# Altium schematic sheet FRONT_INTF.SchDoc: SDR200
size 420 x 297 mm; DocumentNumber: XXXX.468179.001 Э3; SheetNumber: 7; SheetTotal: 7; Title2str: Передняя панель; DocumentType: Схема электрическая принципиальная; Scale: 1:1
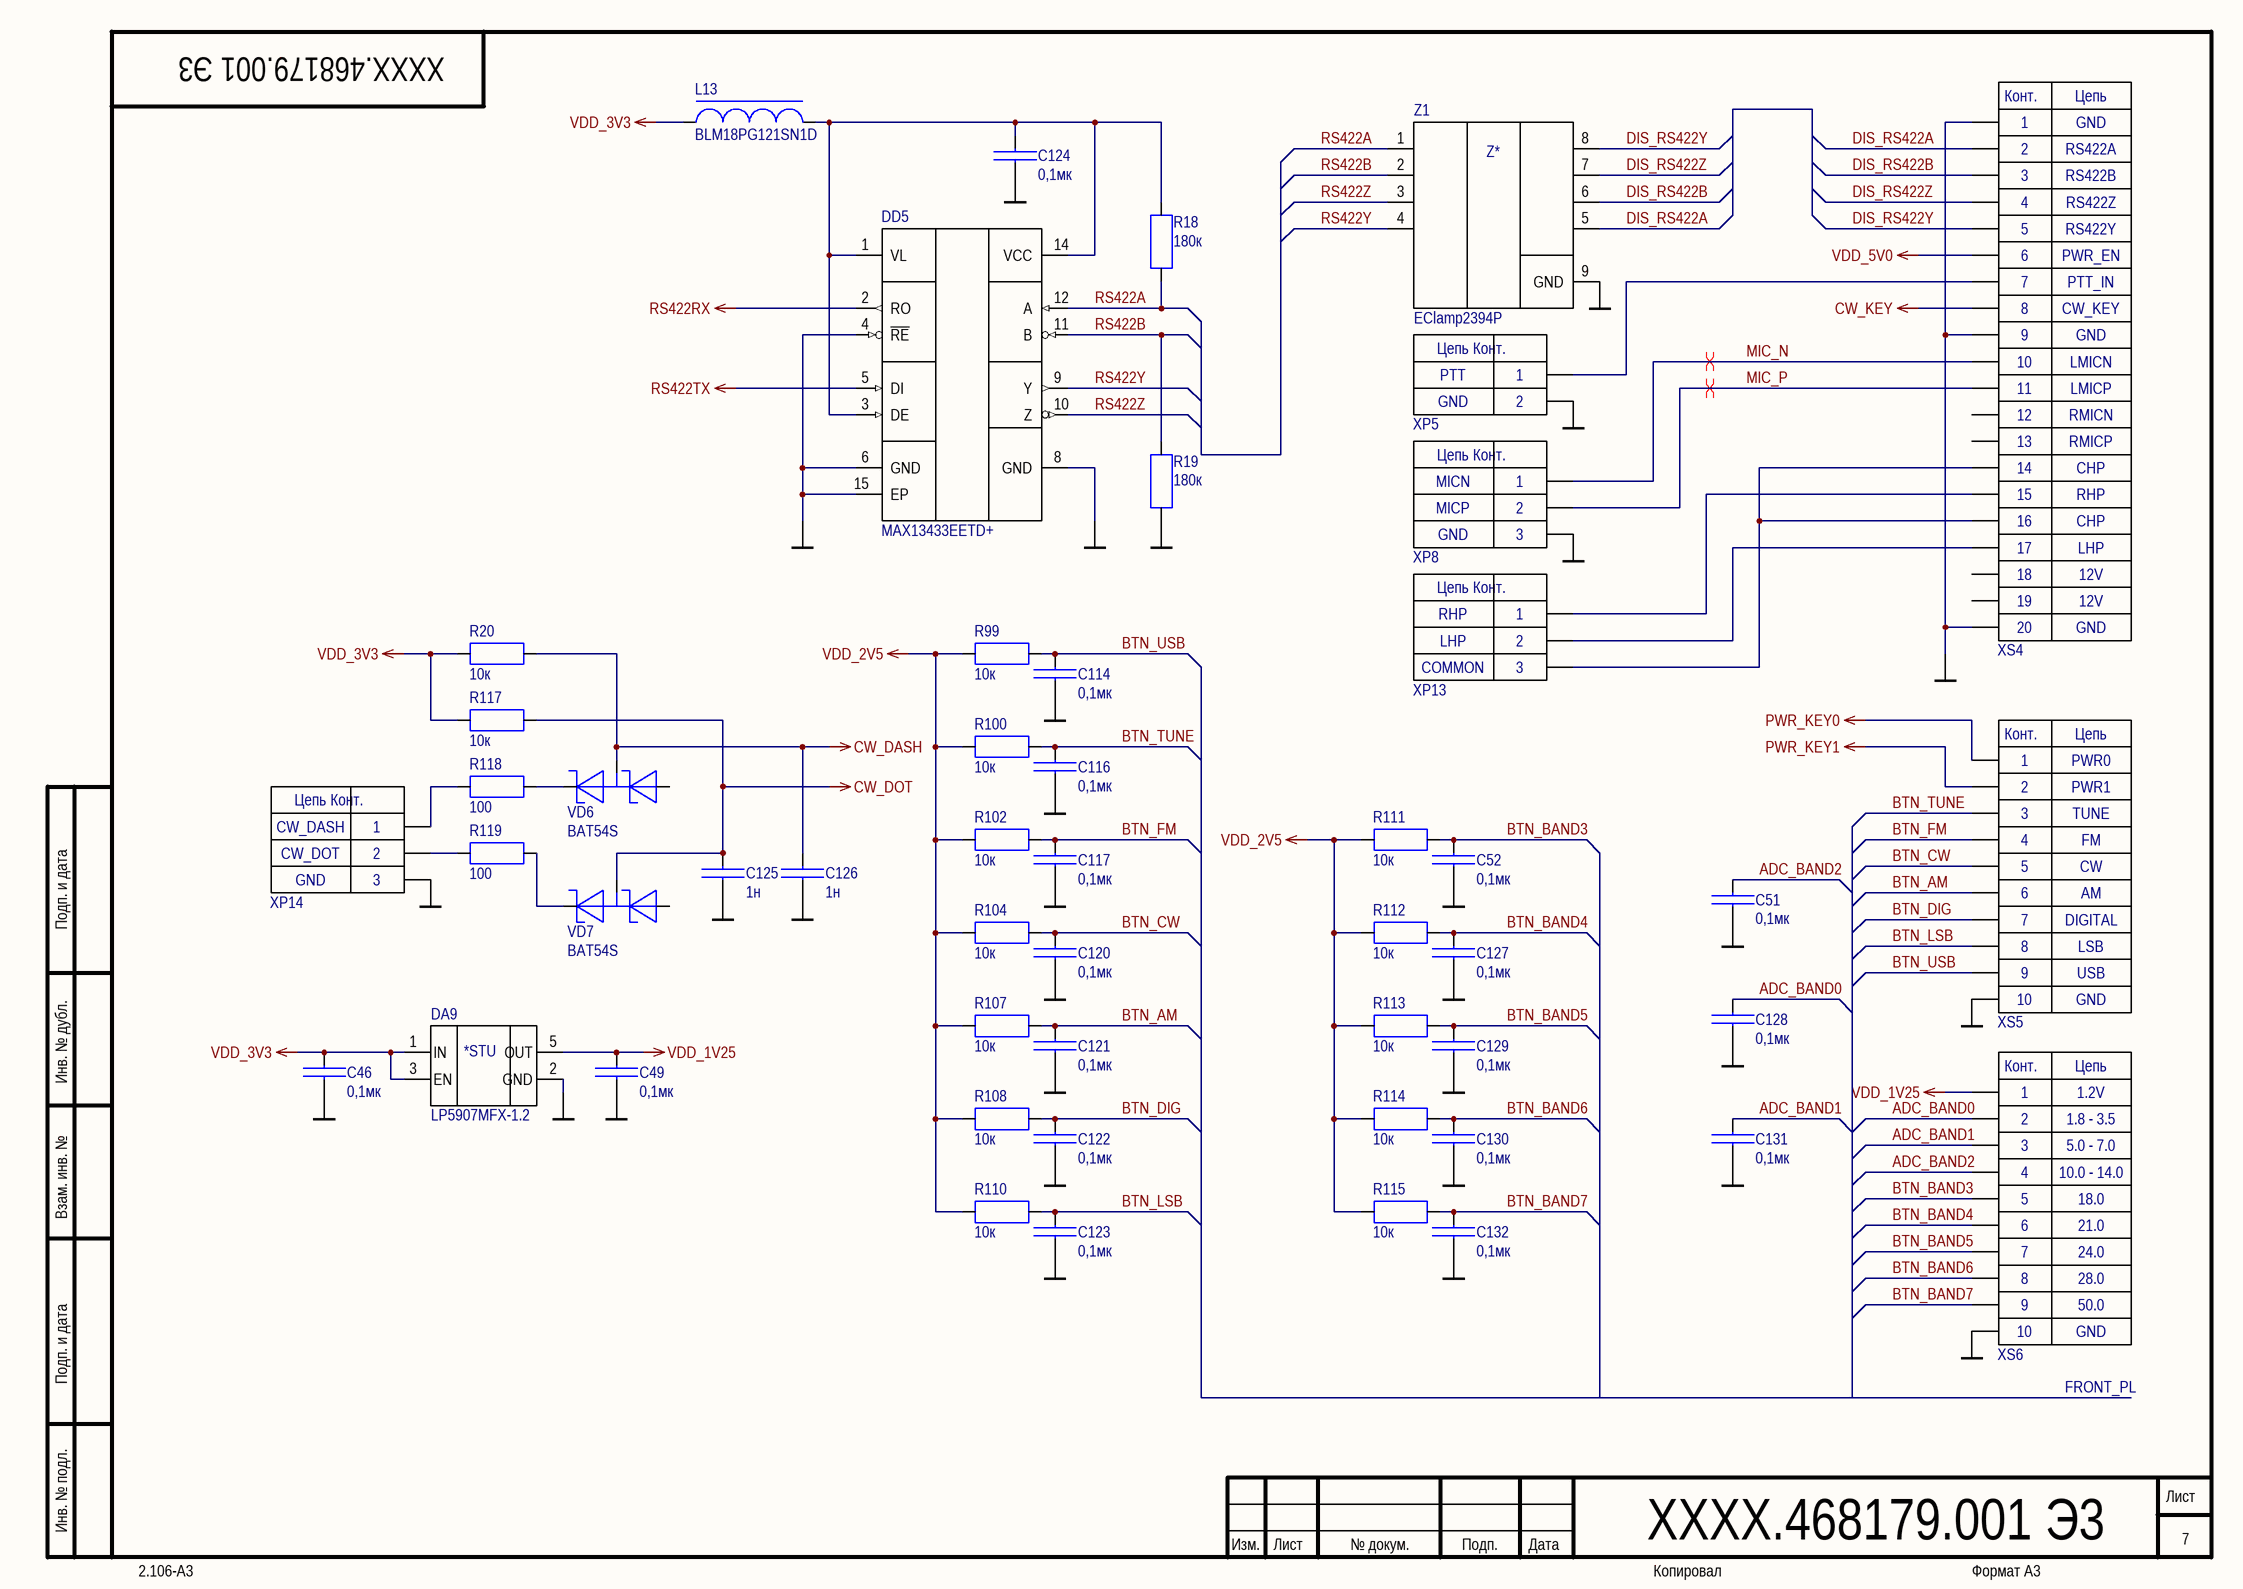
[diagram p0: FRONT_INTF.SchDoc]

## Parts
C46  Nominal: 0,1мк  [CAPC1005X05L]  (hidden comment: CC0402KRX5R6BB104)
C49  Nominal: 0,1мк  [CAPC1005X05L]  (hidden comment: CC0402KRX5R6BB104)
C51  Nominal: 0,1мк  [CAPC1005X05L]  (hidden comment: CC0402KRX5R6BB104)
C52  Nominal: 0,1мк  [CAPC1005X05L]  (hidden comment: CC0402KRX5R6BB104)
C114  Nominal: 0,1мк  [CAPC1005X05L]  (hidden comment: CC0402KRX5R6BB104)
C116  Nominal: 0,1мк  [CAPC1005X05L]  (hidden comment: CC0402KRX5R6BB104)
C117  Nominal: 0,1мк  [CAPC1005X05L]  (hidden comment: CC0402KRX5R6BB104)
C120  Nominal: 0,1мк  [CAPC1005X05L]  (hidden comment: CC0402KRX5R6BB104)
C121  Nominal: 0,1мк  [CAPC1005X05L]  (hidden comment: CC0402KRX5R6BB104)
C122  Nominal: 0,1мк  [CAPC1005X05L]  (hidden comment: CC0402KRX5R6BB104)
C123  Nominal: 0,1мк  [CAPC1005X05L]  (hidden comment: CC0402KRX5R6BB104)
C124  Nominal: 0,1мк  [CAPC1005X05L]  (hidden comment: CC0402KRX5R6BB104)
C125  Nominal: 1н  [CAPC1005X05L]  (hidden comment: C0402C102J5GACTU)
C126  Nominal: 1н  [CAPC1005X05L]  (hidden comment: C0402C102J5GACTU)
C127  Nominal: 0,1мк  [CAPC1005X05L]  (hidden comment: CC0402KRX5R6BB104)
C128  Nominal: 0,1мк  [CAPC1005X05L]  (hidden comment: CC0402KRX5R6BB104)
C129  Nominal: 0,1мк  [CAPC1005X05L]  (hidden comment: CC0402KRX5R6BB104)
C130  Nominal: 0,1мк  [CAPC1005X05L]  (hidden comment: CC0402KRX5R6BB104)
C131  Nominal: 0,1мк  [CAPC1005X05L]  (hidden comment: CC0402KRX5R6BB104)
C132  Nominal: 0,1мк  [CAPC1005X05L]  (hidden comment: CC0402KRX5R6BB104)
DA9  LP5907MFX-1.2  [SOT95P280X145-5L]
DD5  MAX13433EETD+  [SON40P300X80_HS-15L]
L13  BLM18PG121SN1D  [INDC1608X05L]
R18  Nominal: 180к  [RESC1005X04L]  (hidden comment: RC0402JR-07180KL)
R19  Nominal: 180к  [RESC1005X04L]  (hidden comment: RC0402JR-07180KL)
R20  Nominal: 10к  [RESC1005X04L]  (hidden comment: RC0402JR-0710KL)
R99  Nominal: 10к  [RESC1005X04L]  (hidden comment: RC0402JR-0710KL)
R100  Nominal: 10к  [RESC1005X04L]  (hidden comment: RC0402JR-0710KL)
R102  Nominal: 10к  [RESC1005X04L]  (hidden comment: RC0402JR-0710KL)
R104  Nominal: 10к  [RESC1005X04L]  (hidden comment: RC0402JR-0710KL)
R107  Nominal: 10к  [RESC1005X04L]  (hidden comment: RC0402JR-0710KL)
R108  Nominal: 10к  [RESC1005X04L]  (hidden comment: RC0402JR-0710KL)
R110  Nominal: 10к  [RESC1005X04L]  (hidden comment: RC0402JR-0710KL)
R111  Nominal: 10к  [RESC1005X04L]  (hidden comment: RC0402JR-0710KL)
R112  Nominal: 10к  [RESC1005X04L]  (hidden comment: RC0402JR-0710KL)
R113  Nominal: 10к  [RESC1005X04L]  (hidden comment: RC0402JR-0710KL)
R114  Nominal: 10к  [RESC1005X04L]  (hidden comment: RC0402JR-0710KL)
R115  Nominal: 10к  [RESC1005X04L]  (hidden comment: RC0402JR-0710KL)
R117  Nominal: 10к  [RESC1005X04L]  (hidden comment: RC0402JR-0710KL)
R118  Nominal: 100  [RESC1005X04L]  (hidden comment: RC0402JR-07100RL)
R119  Nominal: 100  [RESC1005X04L]  (hidden comment: RC0402JR-07100RL)
VD6  BAT54S  [SOT95P240X120-3L]
VD7  BAT54S  [SOT95P240X120-3L]
XP5  WB-02  [WB-02 (MW-2M) PITCH 2.00MM]  (value not drawn)
XP8  WB-03  [WB-03 (MW-3M) PITCH 2.00MM]  (value not drawn)
XP13  WB-03  [WB-03 (MW-3M) PITCH 2.00MM]  (value not drawn)
XP14  WB-03  [WB-03 (MW-3M) PITCH 2.00MM]  (value not drawn)
XS4  FH12-20S-0.5SVA  [FH12-20S-0.5SVA]  (value not drawn)
XS5  FH12-10S-0.5SVA  [FH12-10S-0.5SH]  (value not drawn)
XS6  FH12-10S-0.5SVA  [FH12-10S-0.5SH]  (value not drawn)
Z1  EClamp2394P  [SON50P160X65_HS-9N]

## Nets
CW_DASH: C126.1 R20.1 VD6.1
CW_DOT: C125.1 R117.1 VD7.1
CW_KEY: XS4.8
GND: C46.1 C49.1 C51.2 C52.2 C114.2 C116.2 C117.2 C120.2 C121.2 C122.2 C123.2 C124.1 C125.2 C126.2 C127.2 C128.2 C129.2 C130.2 C131.2 C132.2 DA9.2(GND) DD5.4(~{RE}) DD5.6(GND) DD5.8(GND) DD5.15(EP) R19.1 XP5.2 XP8.3 XP14.3 XS4.1 XS4.9 XS4.20 XS5.10 XS6.10 Z1.9(GND)
PWR_KEY0: XS5.1
PWR_KEY1: XS5.2
RS422RX: DD5.2(RO)
RS422TX: DD5.5(DI)
VDD_1V25: C49.2 DA9.5(OUT) XS6.1
VDD_2V5: R99.2 R100.2 R102.2 R104.2 R107.2 R108.2 R110.2 R111.2 R112.2 R113.2 R114.2 R115.2
VDD_3V3: C46.2 DA9.1(IN) DA9.3(EN) L13.2 R20.2 R117.2
VDD_5V0: XS4.6
ADC_BAND0: C128.1 XS6.2
ADC_BAND1: C131.1 XS6.3
ADC_BAND2: C51.1 XS6.4
BTN_AM: C121.1 R107.1 XS5.6
BTN_BAND3: C52.1 R111.1 XS6.5
BTN_BAND4: C127.1 R112.1 XS6.6
BTN_BAND5: C129.1 R113.1 XS6.7
BTN_BAND6: C130.1 R114.1 XS6.8
BTN_BAND7: C132.1 R115.1 XS6.9
BTN_CW: C120.1 R104.1 XS5.5
BTN_DIG: C122.1 R108.1 XS5.7
BTN_FM: C117.1 R102.1 XS5.4
BTN_LSB: C123.1 R110.1 XS5.8
BTN_TUNE: C116.1 R100.1 XS5.3
BTN_USB: C114.1 R99.1 XS5.9
DIS_RS422A: XS4.2 Z1.5
DIS_RS422B: XS4.3 Z1.6
DIS_RS422Y: XS4.5 Z1.8
DIS_RS422Z: XS4.4 Z1.7
MIC_N: XP8.1 XS4.10
MIC_P: XP8.2 XS4.11
RS422A: DD5.12(A) R18.1 Z1.1
RS422B: DD5.11(B) R19.2 Z1.2
RS422Y: DD5.9(Y) Z1.4
RS422Z: DD5.10(Z) Z1.3
NetC124_2: C124.2 DD5.1(VL) DD5.3(DE) DD5.14(VCC) L13.1 R18.2
NetR118_1: R118.1 VD6.3(K)
NetR118_2: R118.2 XP14.1
NetR119_1: R119.1 VD7.3(K)
NetR119_2: R119.2 XP14.2
NetXP5_1: XP5.1 XS4.7
NetXP13_1: XP13.1 XS4.15
NetXP13_2: XP13.2 XS4.17
NetXP13_3: XP13.3 XS4.14 XS4.16

Not connected (* = marked no-connect by the designer): VD6 2(A); VD7 2(A); XS4 12 13 18 19

## Layout directives
differential pair: MIC_N, MIC_P

## Notes on the sheet
- GND
- RS422A
- RS422B
- RS422Z
- RS422Y
- PWR_EN
- PTT_IN
- CW_KEY
- PTT
- LMICN
- LMICP
- RMICN
- RMICP
- CHP
- MICN
- MICP
- RHP
- 12V
- LHP
- COMMON
- PWR0
- PWR1
- CW_DASH
- CW_DOT
- CW
- FM
- TUNE
- DIGITAL
- AM
- USB
- LSB
- 1.8 - 3.5
- 1.2V
- 5.0 - 7.0
- (near XS6) 10.0 - 14.0
- 18.0
- 28.0
- 24.0
- 21.0
- 50.0
- FRONT_PL
- Подп. и дата
- Инв. № дубл.
- Взам. инв. №
- Инв. № подл.
- Изм.
- Лист
- № докум.
- Подп.
- Дата
- 2.106-A3
- Копировал
- Формат А3
- (in symbol EClamp2394P) Z*
- (in symbol FH12-10S-0.5SVA) Конт.; Цепь
- (in symbol FH12-20S-0.5SVA) Конт.; Цепь
- (in symbol LP5907MFX-1.2) *STU
- (in symbol WB-02) Цепь; Конт.
- (in symbol WB-03) Цепь; Конт.

## Library data of the parts
C46 C49 C51 C52 C114 C116 C117 C120-C124 C127-C132 = CC0402KRX5R6BB104: ЧИП конденсатор; Manufacturer: Yageo; ID: 0402 0,1 мкФ 10В X7R; Tolerance: 10%; Type: X7R; Value: 0402 0,1 мкФ 10В X7R; RuNominal: 0,1 мкФ; Voltage: 10В; ManufacturerPartNumber: CC0402KRX5R6BB104; Rem: *
C125 C126 = C0402C102J5GACTU: ЧИП конденсатор; Manufacturer: Yageo; ID: 0402 1 нФ 50В C0G; Tolerance: 5%; Type: C0G; Value: 0402 1 нФ 50В C0G; RuNominal: 1 нФ; Voltage: 50В; ManufacturerPartNumber: C0402C102J5GACTU; Rem: *
DA9 = LP5907MFX-1.2: LP5907 250mA, Low-Noise, Low-IQ LDO; Manufacturer: TI; Rem: SOT-23; ComponentLink1Description: datasheet; ComponentLink1URL: *; Value: LP5907MFX-1.2; ID: LP5907MFX-1.2; ManufacturerPartNumber: LP5907MFX-1.2; datasheet: http://www.ti.com/lit/ds/symlink/lp5907.pdf
DD5 = MAX13433EETD+: RS-422 Transceivers with Low-Voltage Logic Interface 16M; Manufacturer: AD; ComponentLink1Description: datasheet; ComponentLink1URL: https://static.chipdip.ru/lib/039/DOC028039660.pdf; ManufacturerPartNumber: MAX13433EETD+; Rem: *; Value: MAX13433EETD+
L13 = BLM18PG121SN1D: Chip Ferrite Beads (0603 Size); Manufacturer: Murata; Rem: 120ohm ±25%; Current: 2000mA; DC Res: 0.05ohm; Nominal: BLM18PG121SN1D; ID: BLM18PG121SN1D; ManufacturerPartNumber: BLM18PG121SN1D; Value: BLM18PG121SN1D
R18 R19 = RC0402JR-07180KL: ЧИП резистор; Manufacturer: Yageo; ID: 0402 180 кОм 5%; Tolerance: 5%; Value: 0402 180 кОм 5%; ManufacturerPartNumber: RC0402JR-07180KL; Rem: *; Type: *
R20 R99 R100 R102 R104 R107 R108 R110-R115 R117 = RC0402JR-0710KL: ЧИП резистор; Manufacturer: Yageo; ID: 0402 10 кОм 5%; Tolerance: 5%; Value: 0402 10 кОм 5%; ManufacturerPartNumber: RC0402JR-0710KL; Rem: *; Type: *
R118 R119 = RC0402JR-07100RL: ЧИП резистор; Manufacturer: Yageo; ID: 0402 100 Ом 5%; Tolerance: 5%; Value: 0402 100 Ом 5%; ManufacturerPartNumber: RC0402JR-07100RL; Rem: *; Type: *
VD6 VD7 = BAT54S: SCHOTTKY DIODE; Manufacturer: International Rectifier; Rem: 0.2Amp 30V; Value: BAT54S; ID: BAT54S; ManufacturerPartNumber: BAT54S; datasheet: https://static.chipdip.ru/lib/196/DOC000196695.pdf
XP5 = WB-02: WB-02 (MW-2M) pitch 2.00mm / DS1066-02M; ManufacturerPartNumber: WB-02
XP8 XP13 XP14 = WB-03: WB-03(MW-3M) pitch 2.00mm / DS1066-03M
XS4 = FH12-20S-0.5SVA: FPC Connectors, Flex-to-Board, 20 Position, .5mm [.02in]; Manufacturer: Hirose; ManufacturerPartNumber: FH12-20S-0.5SVA
XS5 XS6 = FH12-10S-0.5SVA: Manufacturer: Hirose; ManufacturerPartNumber: FH12-10S-0.5SVA
Z1 = EClamp2394P: ESD-EMI 4-line Protection for Color LCD Interfaces; Manufacturer: SEMTECH; Value: EClamp2394P; ComponentLink1Description: datasheet; ComponentLink1URL: https://semtech.my.salesforce.com/sfc/p/#E0000000JelG/a/44000000MCQv/tLOuuaZwODheyCzafOGtui7bNA1cSjYbUE_tOk41Kw4; ManufacturerPartNumber: ECLAMP2394P; Rem: *